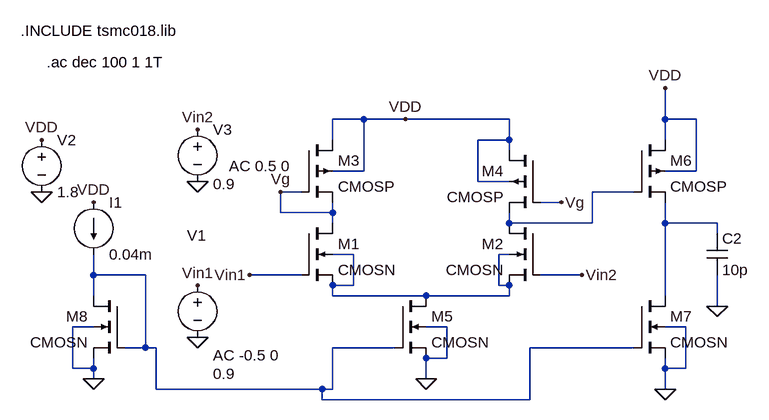
[diagram p0: schematic TwostageopampwoC.asc]
TwostageopampwoC.asc, the LTspice schematic file:
Version 4
SHEET 1 880 680
WIRE -544 -256 -592 -256
WIRE -480 -256 -544 -256
WIRE -320 -256 -480 -256
WIRE -80 -256 -80 -304
WIRE -32 -256 -80 -256
WIRE -592 -224 -592 -256
WIRE -320 -224 -320 -256
WIRE -320 -224 -368 -224
WIRE -80 -224 -80 -256
WIRE -320 -208 -320 -224
WIRE -544 -176 -544 -256
WIRE -544 -176 -592 -176
WIRE -32 -176 -32 -256
WIRE -32 -176 -80 -176
WIRE -368 -160 -368 -224
WIRE -320 -160 -368 -160
WIRE -640 -144 -672 -144
WIRE -128 -144 -192 -144
WIRE -240 -128 -272 -128
WIRE -672 -112 -672 -144
WIRE -592 -112 -592 -128
WIRE -592 -112 -672 -112
WIRE -592 -96 -592 -112
WIRE -320 -96 -320 -112
WIRE -192 -96 -192 -144
WIRE -192 -96 -320 -96
WIRE -80 -96 -80 -128
WIRE 0 -96 -80 -96
WIRE 0 -80 0 -96
WIRE -560 -48 -592 -48
WIRE -320 -48 -336 -48
WIRE -960 -16 -960 -48
WIRE -880 -16 -960 -16
WIRE -640 -16 -720 -16
WIRE -208 -16 -272 -16
WIRE -560 0 -560 -48
WIRE -560 0 -592 0
WIRE -336 0 -336 -48
WIRE -320 0 -336 0
WIRE -960 16 -960 -16
WIRE -592 16 -592 0
WIRE -448 16 -592 16
WIRE -320 16 -320 0
WIRE -320 16 -448 16
WIRE -80 16 -80 -96
WIRE 0 32 0 -16
WIRE -960 64 -992 64
WIRE -416 64 -448 64
WIRE -48 64 -80 64
WIRE -880 96 -880 -16
WIRE -880 96 -912 96
WIRE -864 96 -880 96
WIRE -496 96 -592 96
WIRE -128 96 -288 96
WIRE -416 112 -416 64
WIRE -416 112 -448 112
WIRE -992 128 -992 64
WIRE -960 128 -960 112
WIRE -960 128 -992 128
WIRE -80 128 -80 112
WIRE -48 128 -48 64
WIRE -48 128 -80 128
WIRE -960 144 -960 128
WIRE -448 144 -448 112
WIRE -864 160 -864 96
WIRE -608 160 -864 160
WIRE -592 160 -592 96
WIRE -592 160 -608 160
WIRE -80 160 -80 128
WIRE -608 176 -608 160
WIRE -288 176 -288 96
WIRE -288 176 -608 176
FLAG -1040 -144 0
FLAG -448 144 0
FLAG -1040 -224 VDD
FLAG -480 -256 VDD
FLAG -800 0 Vin1
FLAG -720 -16 Vin1
FLAG -208 -16 Vin2
FLAG -800 80 0
FLAG -800 -160 0
FLAG -800 -240 Vin2
FLAG -960 144 0
FLAG -960 -128 VDD
FLAG -240 -128 Vg
FLAG -672 -144 Vg
FLAG -80 -304 VDD
FLAG -80 160 0
FLAG 0 32 0
DATAFLAG -32 -176 ""
SYMBOL cmosn -496 16 R0
SYMATTR InstName M5
SYMATTR Value2 l=180n w=2072n
SYMBOL cmosn -640 -96 R0
SYMATTR InstName M1
SYMATTR Value2 l=180n w=2876n
SYMBOL cmosn -272 -96 M0
SYMATTR InstName M2
SYMATTR Value2 l=180n w=2876n
SYMBOL voltage -800 -16 R0
WINDOW 3 24 152 Left 2
WINDOW 123 24 124 Left 2
WINDOW 39 0 0 Left 2
WINDOW 0 -16 -61 Left 2
SYMATTR Value 0.9
SYMATTR Value2 AC -0.5 0
SYMATTR InstName V1
SYMBOL voltage -1040 -240 R0
WINDOW 123 0 0 Left 2
WINDOW 39 0 0 Left 2
SYMATTR InstName V2
SYMATTR Value 1.8
SYMBOL voltage -800 -256 R0
WINDOW 3 24 100 Left 2
WINDOW 123 49 72 Left 2
WINDOW 39 0 0 Left 2
SYMATTR Value 0.9
SYMATTR Value2 AC 0.5 0
SYMATTR InstName V3
SYMBOL cmosp -640 -224 R0
SYMATTR InstName M3
SYMATTR Value2 l=180n w=1565n
SYMBOL cmosp -272 -208 M0
SYMATTR InstName M4
SYMATTR Value2 l=180n w=1565n
SYMBOL cmosn -912 16 M0
SYMATTR InstName M8
SYMATTR Value2 l=180n w=3450n
SYMBOL current -960 -128 R0
WINDOW 123 0 0 Left 2
WINDOW 39 0 0 Left 2
SYMATTR InstName I1
SYMATTR Value 0.04m
SYMBOL cmosn -128 16 R0
SYMATTR InstName M7
SYMATTR Value2 l=180n w=17986n
SYMBOL cmosp -128 -224 R0
SYMATTR InstName M6
SYMATTR Value2 l=180n w=52985n
SYMBOL cap -16 -16 M180
WINDOW 0 24 56 Left 2
WINDOW 3 24 8 Left 2
SYMATTR InstName C2
SYMATTR Value 10p
TEXT -1072 -392 Left 2 !.INCLUDE tsmc018.lib
TEXT -1032 -344 Left 2 !.ac dec 100 1 1T

The netlist it stands for:
* TwostageopampwoC.asc
M5 N003 N004 0 0 CMOSN l=180n w=2072n
M1 Vg Vin1 N003 N003 CMOSN l=180n w=2876n
M2 N001 Vin2 N003 N003 CMOSN l=180n w=2876n
V1 Vin1 0 0.9 AC -0.5 0
V2 VDD 0 1.8
V3 Vin2 0 0.9 AC 0.5 0
M3 VDD Vg Vg VDD CMOSP l=180n w=1565n
M4 VDD Vg N001 VDD CMOSP l=180n w=1565n
M8 N004 N004 0 0 CMOSN l=180n w=3450n
I1 VDD N004 0.04m
M7 N002 N004 0 0 CMOSN l=180n w=17986n
M6 VDD N001 N002 VDD CMOSP l=180n w=52985n
C2 0 N002 10p
.model NMOS NMOS
.model PMOS PMOS
.lib standard.mos
.INCLUDE tsmc018.lib
.ac dec 100 1 1T
.backanno
.end